# EAGLE design ATWINC1500-Breakout_v10 (EAGLE 7.7.0)
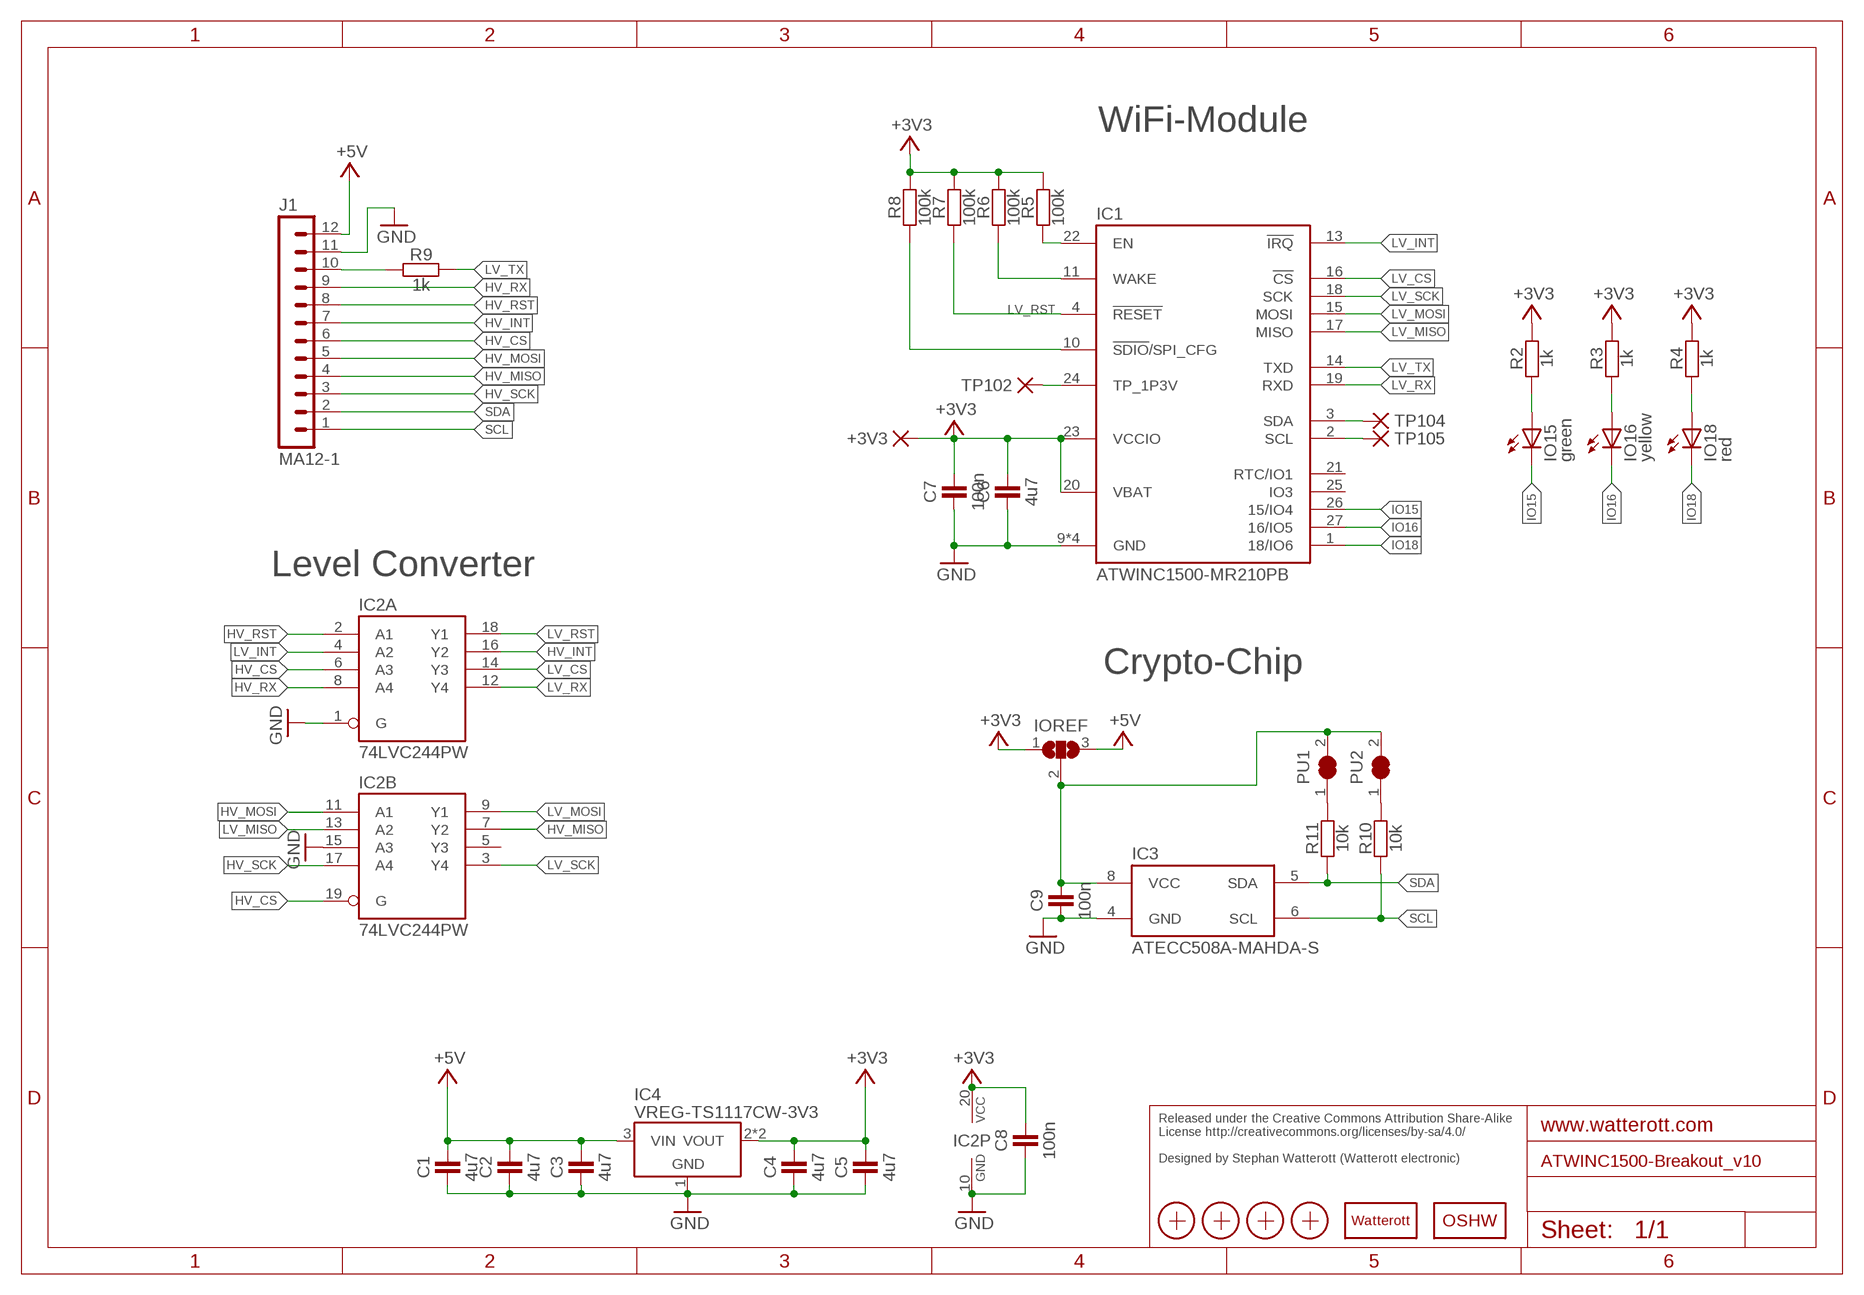
[diagram p0: schematic, sheet 1]

## Parts
+3V3  PAD-1.27X1.27_NC  [PAD-1.27X1.27_NC]
C1  4u7  CAPACITOR-0603  [C0603]
C2  4u7  CAPACITOR-0603  [C0603]
C3  4u7  CAPACITOR-0603  [C0603]
C4  4u7  CAPACITOR-0603  [C0603]
C5  4u7  CAPACITOR-0603  [C0603]
C6  4u7  CAPACITOR-0603  [C0603]
C7  100n  CAPACITOR-0603  [C0603]
C8  100n  CAPACITOR-0402  [C0402]
C9  100n  CAPACITOR-0402  [C0402]
IC1  ATWINC1500-MR210PB  [ATWINC1500-MX210]
IC2  74LVC244PW  [TSSOP20]
IC3  ATECC508A-MAHDA-S  [UDFN8]
IC4  VREG-TS1117CW-3V3  [SOT223]
IO15  green  LED-0603  [C0603]
IO16  yellow  LED-0603  [C0603]
IO18  red  LED-0603  [C0603]
IOREF  JUMPER3-0603-NC  [JUMPER3-0603_NC]
J1  MA12-1  [MA12-1]
LOGO1  LOGO-S_PLACE_M  [SPARK_TPLACE_M]
LOGO2  OSHW_LOGOX0100  [OSHW_6X100]
PU1  JUMPER2-0603-NC  [JUMPER2-0603_NC]
PU2  JUMPER2-0603-NC  [JUMPER2-0603_NC]
R2  1k  RESISTOR-0402  [C0402]
R3  1k  RESISTOR-0402  [C0402]
R4  1k  RESISTOR-0402  [C0402]
R5  100k  RESISTOR-0402  [C0402]
R6  100k  RESISTOR-0402  [C0402]
R7  100k  RESISTOR-0402  [C0402]
R8  100k  RESISTOR-0402  [C0402]
R9  1k  RESISTOR-0402  [C0402]
R10  10k  RESISTOR-0402  [C0402]
R11  10k  RESISTOR-0402  [C0402]
TP102  PAD-1.27X1.27_NC  [PAD-1.27X1.27_NC]
TP104  PAD-1.27X1.27_NC  [PAD-1.27X1.27_NC]
TP105  PAD-1.27X1.27_NC  [PAD-1.27X1.27_NC]
X1  PASSER-07  [PASSER_07MM]
X2  PASSER-07  [PASSER_07MM]
X3  PASSER-07  [PASSER_07MM]
X4  PASSER-07  [PASSER_07MM]

## Nets
+3V3: +3V3.1(P) C4.2 C5.2 C6.2 C7.2 C8.2 IC1.20(VBAT) IC1.23(VCCIO) IC2.20(P:VCC) IC4.2(VOUT) IC4.4(VOUT) IOREF.1 R2.2 R3.2 R4.2 R5.2 R6.2 R7.2 R8.2
+5V: C1.2 C2.2 C3.2 IC4.3(VIN) IOREF.3 J1.12
GND: C1.1 C2.1 C3.1 C4.1 C5.1 C6.1 C7.1 C8.1 C9.1 IC1.9(GND) IC1.12(GND) IC1.28(GND) IC1.GND IC2.1(A:G) IC2.10(P:GND) IC2.15(B:A3) IC3.4(GND) IC4.1(GND) J1.11
HV_CS: IC2.6(A:A3) IC2.19(B:G) J1.6
HV_INT: IC2.16(A:Y2) J1.7
HV_MISO: IC2.7(B:Y2) J1.4
HV_MOSI: IC2.11(B:A1) J1.5
HV_RST: IC2.2(A:A1) J1.8
HV_RX: IC2.8(A:A4) J1.9
HV_SCK: IC2.17(B:A4) J1.3
IO15: IC1.26(15/IO4) IO15.C
IO16: IC1.27(16/IO5) IO16.C
IO18: IC1.1(18/IO6) IO18.C
IOREF: C9.2 IC3.8(VCC) IOREF.2 PU1.2 PU2.2
LED15: IO15.A R2.1
LED16: IO16.A R3.1
LED18: IO18.A R4.1
LV_CS: IC1.16(!CS) IC2.14(A:Y3)
LV_EN: IC1.22(EN) R5.1
LV_INT: IC1.13(!IRQ) IC2.4(A:A2)
LV_MISO: IC1.17(MISO) IC2.13(B:A2)
LV_MOSI: IC1.15(MOSI) IC2.9(B:Y1)
LV_RST: IC1.4(!RESET) IC2.18(A:Y1) R7.1
LV_RX: IC1.19(RXD) IC2.12(A:Y4)
LV_SCK: IC1.18(SCK) IC2.3(B:Y4)
LV_TX: IC1.14(TXD) R9.2
LV_WAKE: IC1.11(WAKE) R6.1
N$1: J1.10 R9.1
N$6: PU2.1 R10.2
N$7: PU1.1 R11.2
SCL: IC3.6(SCL) J1.1 R10.1
SDA: IC3.5(SDA) J1.2 R11.1
SPI_CFG: IC1.10(!SDIO!/SPI_CFG) R8.1
TP: IC1.24(TP_1P3V) TP102.1(P)
WIFI_SCL: IC1.2(SCL) TP105.1(P)
WIFI_SDA: IC1.3(SDA) TP104.1(P)
Unconnected: IC1.21(RTC/IO1) IC1.25(IO3) IC2.5(B:Y3)

## Notes on the sheet
- WiFi-Module
- Level Converter
- Crypto-Chip
- Released under the Creative Commons Attribution Share-Alike
  License http://creativecommons.org/licenses/by-sa/4.0/
  
  Designed by Stephan Watterott (Watterott electronic)

## Library data of the parts
+3V3 TP102 TP104 TP105 = we-rcl:PAD: Pads
C1-C9 = we-rcl:CAPACITOR: Capacitors ...2.2uF @ 6.3V -> 0402 ...4.7uF @ 6.3V -> 0603 ...10uF @ 16V -> 0805 ...22uF @ 25V -> 1206
IC1 = we-chip:ATWINC1500: Atmel ATWINC1500-MR210 WiFi/WLAN 802.11 b/g/n MR210PB - PCB antenna MR210UB - uFL connector
IC2 = we-chip:74*244: 74x244 Octal Buffer and Line Driver (3-State); DIGIKEY: 568-1583-2-ND
IC3 = we-chip:ATECC508A: Atmel ATECC508A Crypto-Authentication Device
IC4 = we-power:VREG: Voltage Regulators (LDOs, Switching Converters...) LDOs Taiwan Semi TS1117 800mA max 15V - compatible On Semi NCP1117 1A max 20V Taiwan Semi TS9011 250mA max 12V - compatible Diodes AP2210 300mA max 15V - compatible Microchip MCP1702 250mA max 13V - compatible Microchip MCP1703 250mA max 16V - compatible Microchip MCP1754 150mA max 16V Taiwan Semi TS5204 150mA max 16V (low noise) DC/DC Converter Modules Recom R-78Ex.x-1.0-W36 1A max 28V Murata OKI-78SR-x.x/1.5-W36 1.5A max 36V
IO15 IO16 IO18 = we-opto:LED: LEDs red, green, blue -> 0603
IOREF = we-rcl:JUMPER3: 3 Pin Jumpers
J1 = we-con:MA12-1: Pin Header
LOGO1 = we-symbol:LOGO: Watterott electronic Logo
LOGO2 = we-symbol:OSHW_LOGO: Open-Source-Hardware Logo
PU1 PU2 = we-rcl:JUMPER2: 2 Pin Jumpers
R2-R11 = we-rcl:RESISTOR: Resistors all kinds in 0402 and 0603
X1-X4 = we-symbol:PASSER: Fiducial Markers

## Board
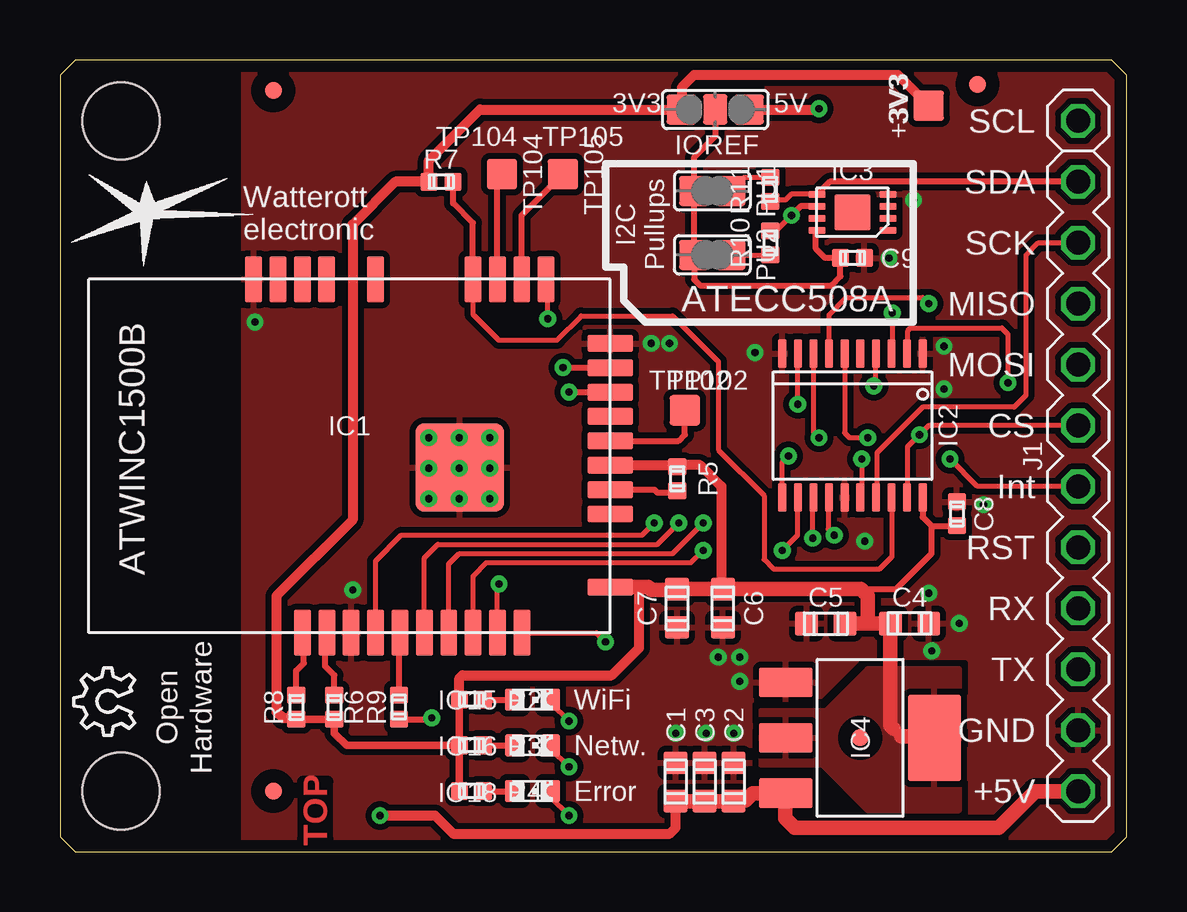
[diagram p1: board, top side]
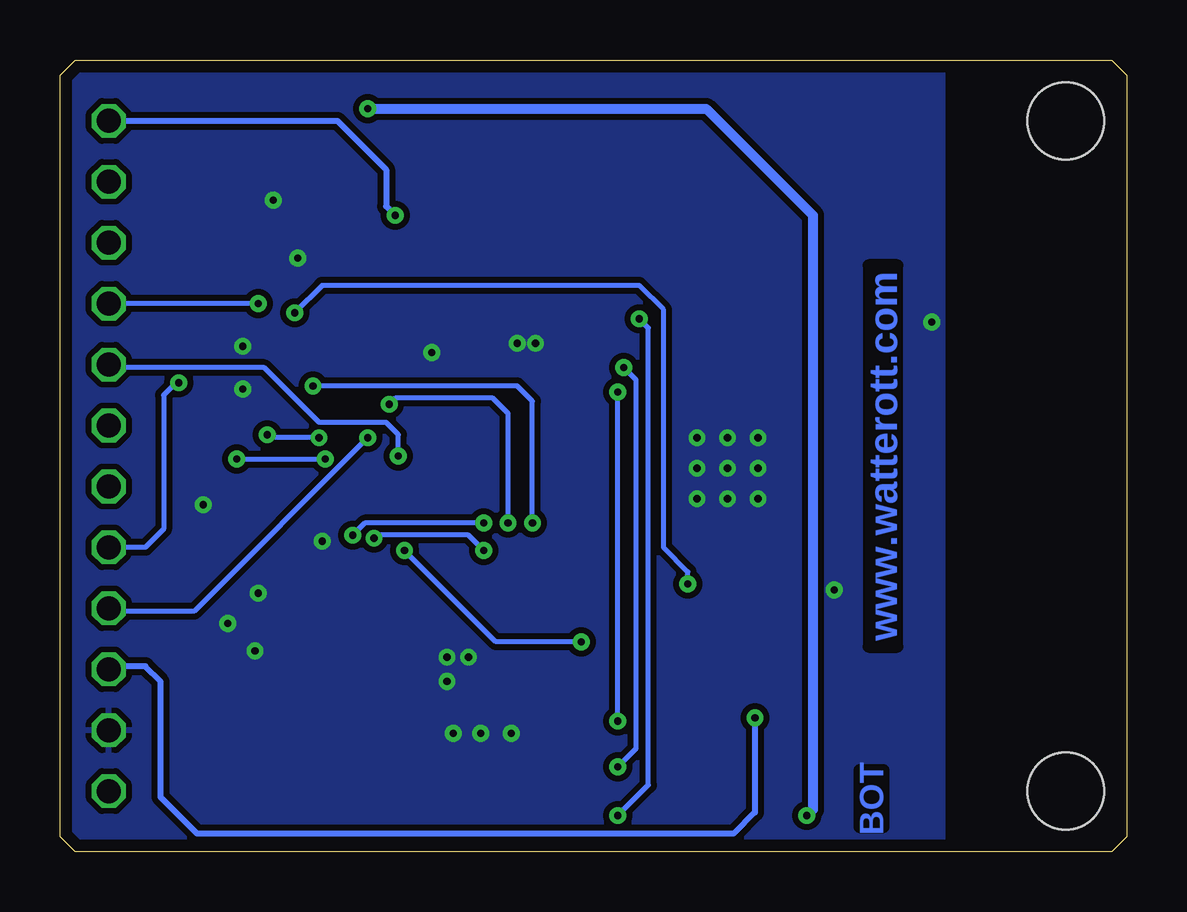
[diagram p2: board, bottom side, seen from below]

Size 44.45 x 33.02 mm. Coordinates in mm from the lower left corner, seen from the top.
Outline: 0.64,0 43.81,0 44.45,0.64 44.45,32.38 43.81,33.02 0.64,33.02 0,32.38 0,0.64 0.64,0
Copper layers (1*16): Top 0.035mm / dielectric 1.5mm / Bottom 0.035mm
Design rules "we-dru-2-layer": minimum track width 0.15mm, minimum drill 0.3mm, track to track 0.15mm, track to pad 0.15mm, pad to pad 0.15mm, via to via 0.15mm, smd to smd 0.1mm, copper to edge 0.5mm, drill to drill 0.2mm, minimum pad ring 0.18mm, minimum via ring 0.2mm, stop-mask expansion 0.1mm, vias tented up to drill 0.5mm, thermal gap 0.25mm
Holes 3.2 mm at 2.54,30.48 2.54,2.54
tRestrict: area 0,0 to 7.3,33
bRestrict: area 0,0 to 7.3,33

### Footprints (pad centres in the part's own frame; a part is rotated, then mirrored left to right if it is on the bottom)
PAD-1.27X1.27_NC = smd 1.27 x 1.27: 1 0,0
C0603 = smd 1 x 0.95: 1 0,0.8; 2 0,-0.8
C0402 = smd 0.75 x 0.7: 1 0,0.5; 2 0,-0.5
ATWINC1500-MX210 = smd 1.9 x 0.7: 1 7.365,-8.19; 2 7.365,-7.174; 3 7.365,-6.158; 4 7.365,-5.142; 5 7.365,-1.078; 6 7.365,0.954; 7 7.365,1.97; 8 7.365,2.986; 9 7.365,4.002; 10 -7.365,1.964; 11 -7.365,0.948; 12 -7.365,-0.068; 13 -7.365,-1.084; 14 -7.365,-2.1; 15 -7.365,-3.116; 16 -7.365,-4.132; 17 -7.365,-5.148; 18 -7.365,-6.164; 19 -7.365,-7.18 | smd 0.7 x 1.9: 20 -5.465,-10.86; 21 -2.417,-10.86; 22 -1.401,-10.86; 23 -0.385,-10.86; 24 0.631,-10.86; 25 1.647,-10.86; 26 2.663,-10.86; 27 3.679,-10.86; 28 4.695,-10.86 | smd 3.7 x 3.7: GND -0.485,-4.59
TSSOP20 = smd 1.2 x 0.35: 1 -3,2.925; 2 -3,2.275; 3 -3,1.625; 4 -3,0.975; 5 -3,0.325; 6 -3,-0.325; 7 -3,-0.975; 8 -3,-1.625; 9 -3,-2.275; 10 -3,-2.925; 11 3,-2.925; 12 3,-2.275; 13 3,-1.625; 14 3,-0.975; 15 3,-0.325; 16 3,0.325; 17 3,0.975; 18 3,1.625; 19 3,2.275; 20 3,2.925
UDFN8 = smd 0.7 x 0.28: 1 -1.475,0.75; 2 -1.475,0.25; 3 -1.475,-0.25; 4 -1.475,-0.75; 5 1.475,-0.75; 6 1.475,-0.25; 7 1.475,0.25; 8 1.475,0.75 | smd 1.5 x 1.5: TP 0,0
SOT223 = smd 2.235 x 1.219: 1 -3.099,2.311; 2 -3.099,0; 3 -3.099,-2.311 | smd 2.2 x 3.6: 4 3.099,0
C0603' = smd 0.9 x 0.8: A 0,-0.75; C 0,0.75
JUMPER3-0603_NC = smd 1.25 x 1.25: 1 0,1.4; 3 0,-1.4 | smd 1.25 x 1: 2 0,0
MA12-1 = drill 1 octagon: 1 0,13.97; 2 0,11.43; 3 0,8.89; 4 0,6.35; 5 0,3.81; 6 0,1.27; 7 0,-1.27; 8 0,-3.81; 9 0,-6.35; 10 0,-8.89; 11 0,-11.43; 12 0,-13.97
JUMPER2-0603_NC = smd 1.25 x 1.25: 1 0,0.76; 2 0,-0.76
PASSER_07MM = smd 0.7 x 0.7: X 0,0

### Placement (x,y rotation side)
+3V3  36.2,31.11 0 top
C1  25.65,2.92 0 top
C2  28.07,2.92 0 top
C3  26.86,2.92 0 top
C4  35.4,9.53 270 top
C5  31.91,9.53 90 top
C6  27.62,10.16 180 top
C7  25.72,10.16 180 top
C8  37.37,14.1 0 top
C9  33.02,24.77 270 top
IC1  12.06,16.51 90 top
IC2  33.02,17.78 270 top
IC3  33.02,26.67 180 top
IC4  33.34,4.76 0 top
IO15  green  [C0603']  19.68,6.35 270 top
IO16  yellow  [C0603']  19.68,4.45 270 top
IO18  red  [C0603']  19.68,2.54 270 top
IOREF  27.3,30.96 90 top
J1  42.42,16.51 0 top
LOGO1  3.65,26.67 0 top
LOGO2  3.11,4.86 90 top
PU1  27.18,27.56 270 top
PU2  27.18,24.89 270 top
R2  17.14,6.35 270 top
R3  17.14,4.45 270 top
R4  17.14,2.54 270 top
R5  25.72,15.56 180 top
R6  11.43,6.03 0 top
R7  15.88,27.94 270 top
R8  9.84,6.03 0 top
R9  14.13,6.03 180 top
R10  29.59,25.4 0 top
R11  29.59,27.62 180 top
TP102  26.04,18.41 90 top
TP104  18.41,28.26 0 top
TP105  20.95,28.26 0 top
X1  8.89,2.54 0 top
X2  8.89,31.75 0 top
X3  38.23,32 0 top
X4  33.34,4.76 0 top

### Tracks (layer width: path | path; a pad name or v marks a point on that pad's centre or on a via)
+3V3
  Top 0.254: IC2.20 35.95,13.97 36.32,13.59 | 36.32,13.59 C8.2 | 33.36,10.96 34.84,10.96 36.32,12.45 36.32,13.59
  Top 0.305: R4.2 R3.2 | R2.2 R3.2 | R8.2 R6.2 11.43,4.95 11.94,4.45 R3.2
  Top 0.406: +3V3.1 34.92,32.38 26.42,32.38 25.91,31.88 IOREF.1 17.49,30.96 15.37,28.83 15.37,27.95 R7.2 13.97,27.94 12.19,26.16 12.19,13.84 9.02,10.67 9.02,5.84 9.27,5.59 9.79,5.59 R8.2 | 25.66,16 R5.2 | C6.2 27.56,11.02 27.56,15.24 26.67,16.12 25.79,16.12 R5.2 | IC1.23 25.65,16.12 R5.2 | R2.2 16.64,7.25 16.76,7.37 22.99,7.37 24.13,8.51 24.13,11.04
  Top 0.61: 34.73,5.14 34.6,5.28 C4.2 33.66,9.53 | 35.05,4.83 36.37,4.83 IC4.4 | 33.66,9.53 C5.2 | IC1.20 24.13,11.04 24.52,11.04 24.64,10.92 25.68,10.92 C7.2 C6.2 33.36,10.96 33.66,10.67 33.66,9.53
  pour Top (isolate 0.254): 29.21,5.87 29.21,3.65 31.75,3.65 33.66,1.75 37.47,1.75 37.47,7.62 33.66,7.62 31.91,5.87
+5V  (via drill 0.3)
  Top 0.406: IOREF.3 31.59,30.96 v31.62,30.99 | v13.34,1.52 15.62,1.52 16.38,0.76 25.4,0.76 25.65,1.02 C1.2
  Top 0.61: J1.12 40.64,2.54 39.12,1.02 30.61,1.02 30.23,1.4 30.23,2.44 IC4.3 28.87,2.45 28.57,2.16 28.03,2.16 C2.2 C3.2 C1.2
  Bottom 0.406: v31.62,30.99 17.53,30.99 13.08,26.54 13.08,1.78 v13.34,1.52
GND  (via drill 0.3)
  other vias: 15.37,17.27 16.64,17.27 17.91,17.27 15.37,16 15.37,14.73 16.64,16 16.64,14.73 17.91,16 17.91,14.73 24.64,21.21 25.4,21.21 27.43,8.13 28.32,8.13 28.32,7.11 28.07,4.95 26.92,4.95 25.65,4.95 37.47,9.53 36.32,8.38 36.2,10.79 34.54,24.77 35.56,27.18 36.83,21.08 38.48,14.48 33.53,12.95 28.96,20.83 12.19,10.92 8.13,22.1 36.83,19.3
  pour Top (isolate 0.25, rank 2): 44.45,0 0,0 0,33.02 44.45,33.02
  pour Bottom (isolate 0.25, rank 2): 0,0 44.45,0 44.45,33.02 0,33.02
HV_CS  (via drill 0.3)
  Top 0.2: J1.6 36.2,17.78 v35.81,17.4 35.31,16.89 35.31,14.79 IC2.19 | IC2.6 32.7,17.47 32.89,17.27 v33.66,17.27
  Bottom 0.2: v33.66,17.27 35.69,17.27 v35.81,17.4
HV_INT  (via drill 0.3)
  Top 0.2: J1.7 38.23,15.24 v37.08,16.38 | v33.4,16.38 33.4,14.84 IC2.16
  Bottom 0.2: v37.08,16.38 v33.4,16.38
HV_MISO  (via drill 0.3)
  Top 0.2: IC2.7 32.05,22.39 32.77,23.11 35.94,23.11 v36.2,22.86
  Bottom 0.2: v36.2,22.86 J1.4
HV_MOSI  (via drill 0.3)
  Top 0.2: IC2.11 30.09,16.25 v30.35,16.51
  Bottom 0.2: v30.35,16.51 30.35,17.4 30.86,17.91 33.66,17.91 35.94,20.19 42.29,20.19 J1.5
HV_RST  (via drill 0.3)
  Top 0.2: IC2.2 35.31,20.79 35.31,21.72 35.43,21.84 39.24,21.84 39.5,21.59 v39.5,19.56
  Bottom 0.2: J1.8 40.89,12.7 40.13,13.46 40.13,19.05 39.62,19.56 v39.5,19.56
HV_RX  (via drill 0.3)
  Top 0.2: IC2.8 31.39,17.5 v31.62,17.27
  Bottom 0.2: v31.62,17.27 38.86,10.03 42.29,10.03 J1.9
HV_SCK
  Top 0.2: J1.3 40.77,25.4 40.26,24.89 40.26,19.05 39.75,18.54 35.94,18.54 34.04,16.64 34.04,14.82 IC2.17
IO15  (via drill 0.3)
  Top 0.2: 20.43,6.24 v21.21,5.46
  Top 0.254: IO15.C 20.43,6.24 | v21.21,19.18 IC1.26
  Bottom 0.2: v21.21,5.46 v21.21,19.18
IO16  (via drill 0.3)
  Top 0.2: 20.43,4.33 v21.21,3.56
  Top 0.254: IO16.C 20.43,4.33 | v20.95,20.19 IC1.27
  Bottom 0.2: v21.21,3.56 20.45,4.32 20.45,19.68 v20.95,20.19
IO18  (via drill 0.3)
  Top 0.2: 20.43,2.3 v21.21,1.52 | v20.32,22.23 20.32,23.81
  Top 0.254: IO18.C 20.43,2.3 | 20.32,23.81 IC1.1
  Bottom 0.2: v21.21,1.52 19.94,2.79 19.94,21.84 v20.32,22.23
IOREF
  Top 0.254: IC3.8 31.5,25.87 31.5,25.15 31.88,24.77 C9.2 32.51,24.76 32.51,24 32.13,23.62 26.67,23.62 26.42,23.87 PU2.2 PU1.2 26.42,28.96 27.3,29.84 IOREF.2
LED15
  Top 0.254: R2.1 IO15.A
LED16
  Top 0.254: R3.1 IO16.A
LED18
  Top 0.254: R4.1 IO18.A
LV_CS  (via drill 0.3)
  Top 0.2: IC1.16 16.2,12.01 16.64,12.45 25.53,12.45 v26.8,13.72 | 32,14.74 32,13.46 v32.26,13.21
  Top 0.254: 32,14.74 IC2.14
  Bottom 0.2: v26.8,13.72 31.75,13.72 v32.26,13.21
LV_EN
  Top 0.254: IC1.22 24.77,15.11 24.89,14.99 25.65,14.99 R5.1
LV_INT  (via drill 0.3)
  Top 0.2: IC1.13 13.15,12.13 14.22,13.21 24.26,13.21 v24.77,13.72 | v33.91,19.43 33.99,19.52 IC2.4
  Bottom 0.2: v24.77,13.72 24.77,18.8 25.4,19.43 v33.91,19.43
LV_MISO  (via drill 0.3)
  Top 0.2: IC1.17 17.21,11.5 17.78,12.06 26.29,12.06 v26.8,12.57 | v31.37,13.08 31.37,14.75
  Top 0.254: 31.37,14.75 IC2.13
  Bottom 0.2: v26.8,12.57 27.43,13.21 31.24,13.21 v31.37,13.08
LV_MOSI  (via drill 0.3)
  Top 0.2: IC1.15 15.18,12.26 15.75,12.83 24.89,12.83 v25.78,13.72 | v30.73,18.67 30.73,20.77
  Top 0.254: 30.73,20.77 IC2.9
  Bottom 0.2: v25.78,13.72 25.78,18.29 26.42,18.92 30.48,18.92 v30.73,18.67
LV_RST
  Top 0.2: IC1.4 17.21,22.42 18.29,21.34 20.7,21.34 21.72,22.35 25.53,22.35 27.43,20.45 27.43,16.76 29.34,14.86 29.34,12.19 29.72,11.81 34.16,11.81 34.67,12.32 34.67,14.75 IC2.18
  Top 0.254: IC1.4 17.21,26.23 16.38,27.05 R7.1
LV_RX  (via drill 0.3)
  Top 0.2: IC1.19 22.35,9.14 v22.73,8.76 | v30.1,12.57 30.73,13.21 30.73,14.77 IC2.12
  Bottom 0.2: v22.73,8.76 26.29,8.76 v30.1,12.57
LV_SCK  (via drill 0.3)
  Top 0.2: IC1.18 18.23,11.12 v18.29,11.18 | v34.67,22.48 34.67,20.81 IC2.3
  Bottom 0.2: v18.29,11.18 18.29,11.68 19.3,12.7 19.3,22.61 20.32,23.62 33.53,23.62 v34.67,22.48
LV_TX
  Top 0.254: R9.2 14.13,9.11 IC1.14
LV_WAKE
  Top 0.254: R6.1 11.43,7.37 11.05,7.75 11.05,9.08 IC1.11
N$1  (via drill 0.3)
  Top 0.254: R9.1 15.44,5.53 v15.49,5.59
  Bottom 0.254: v15.49,5.59 15.49,1.65 16.38,0.76 38.73,0.76 40.26,2.29 40.26,7.11 40.89,7.75 42.29,7.75 J1.10
N$6
  Top 0.2: PU2.1 R10.2
N$7
  Top 0.2: R11.2 28.5,28.12 PU1.1
SCL  (via drill 0.3)
  Top 0.2: R10.1 29.84,25.9 v30.48,26.54
  Top 0.254: IC3.6 30.86,26.92 v30.48,26.54
  Bottom 0.254: J1.1 32.89,30.48 30.86,28.45 30.86,26.92 v30.48,26.54
SDA
  Top 0.2: IC3.5 30.47,27.42 30.23,27.18 29.65,27.18 R11.1
  Top 0.254: J1.2 32.06,27.94 IC3.5
SPI_CFG
  Top 0.254: R8.1 9.84,7.56 10.16,7.87 10.16,9.09 IC1.10
TP
  Top 0.254: IC1.24 25.78,17.14 26.04,17.4 TP102.1
WIFI_SCL
  Top 0.254: IC1.2 19.24,26.54 TP105.1
WIFI_SDA
  Top 0.254: IC1.3 18.22,28.07 TP104.1

### Text on the board
Top: TOP
Bottom: www.watterott.com | BOT
tPlace: 3V3 | 3V3 | 5V | TP104 | TP105 | SCL | Watterott / electronic | SDA | I2C / Pullups | SCK | ATECC508A | MISO | TP102 | MOSI | CS | ATWINC1500B | Int | RST | RX | TX | Open | Hardware | WiFi | GND | Netw. | Error | +5V
Reference: Silkscreen: 21 tPlace